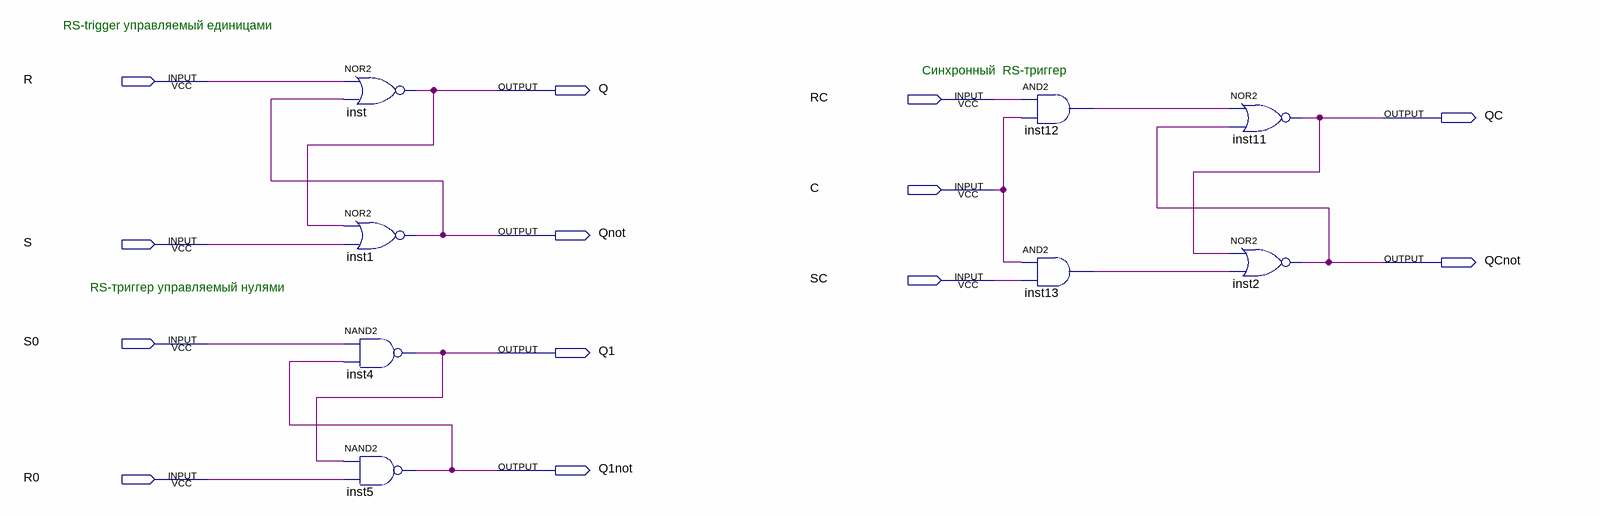
[diagram p0: schematic sheet]
// Quartus schematic rs-trigger.bdf as structural Verilog: 8 symbols, 13 pins
module \rs-trigger  (
  input  R,
  input  RC,
  input  C,
  input  S,
  input  SC,
  input  S0,
  input  R0,
  output Q,
  output QC,
  output Qnot,
  output QCnot,
  output Q1,
  output Q1not
);

  wire inst12_out, inst13_out;

  nor inst (Q, R, Qnot);
  nor inst1 (Qnot, Q, S);
  nand inst4 (Q1, S0, Q1not);
  nand inst5 (Q1not, Q1, R0);
  and inst12 (inst12_out, RC, C);
  and inst13 (inst13_out, C, SC);
  nor inst11 (QC, inst12_out, QCnot);
  nor inst2 (QCnot, QC, inst13_out);

  // Notes on the sheet:
  //   RS-trigger управляемый единицами
  //   Синхронный  RS-триггер
  //   RS-триггер управляемый нулями
endmodule
